# EAGLE schematic Smart_IOT_v1 (EAGLE 6.6.0)
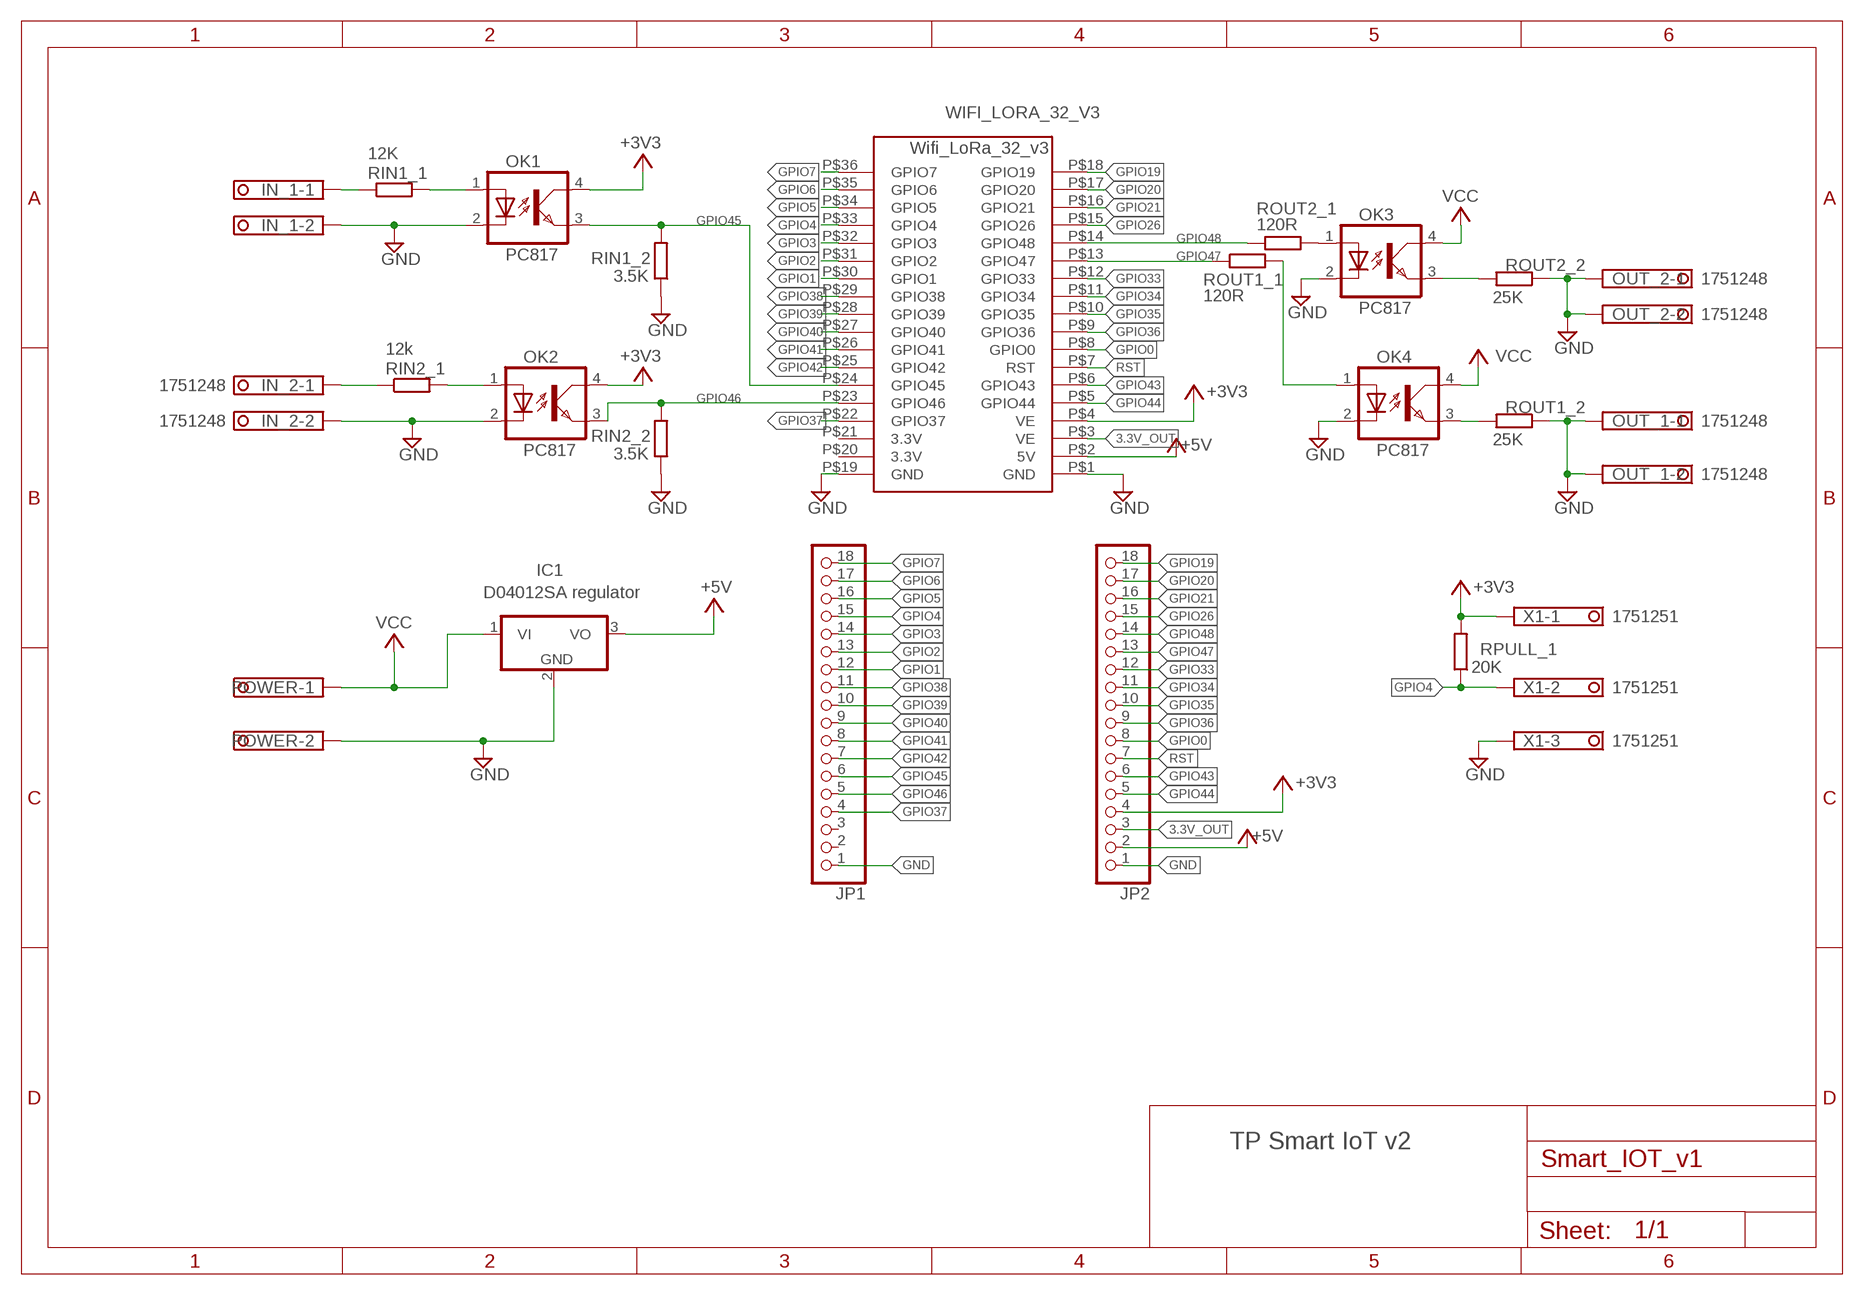
[diagram p0: schematic, sheet 1]

## Parts
IC1  7805TV  [TO220V]
IN_1  1751248  [1751248]
IN_2  1751248  [1751248]
JP1  PINHD-1X18  [1X18]
JP2  PINHD-1X18  [1X18]
OK1  PC817  [DIL04]
OK2  PC817  [DIL04]
OK3  PC817  [DIL04]
OK4  PC817  [DIL04]
OUT_1  1751248  [1751248]
OUT_2  1751248  [1751248]
POWER  1751248  [1751248]
RIN1_1  12K  R-EU_M1206  [M1206]
RIN1_2  3.5K  R-EU_M1206  [M1206]
RIN2_1  12k  R-EU_M1206  [M1206]
RIN2_2  3.5K  R-EU_M1206  [M1206]
ROUT1_1  120R  R-EU_M1206  [M1206]
ROUT1_2  25K  R-EU_M1206  [M1206]
ROUT2_1  120R  R-EU_M1206  [M1206]
ROUT2_2  25K  R-EU_M1206  [M1206]
RPULL_1  20K  R-EU_M1206  [M1206]
WIFI_LORA_32_V3  WIFI_LORA_32_V3  [WIFI_LORA_32_V3]
X1  1751251  [1751251]

## Nets
3.3V_OUT: JP2.3 WIFI_LORA_32_V3.P$3(VE)
+3V3: JP2.4 OK1.4(COL) OK2.4(COL) RPULL_1.2 WIFI_LORA_32_V3.P$4(VE) X1.1
+5V: IC1.3(VO) JP2.2 WIFI_LORA_32_V3.P$2(5V)
GND: IC1.2(GND) IN_1.2 IN_2.2 JP1.1 JP2.1 OK1.2(C) OK2.2(C) OK3.2(C) OK4.2(C) OUT_1.1 OUT_1.2 OUT_2.1 OUT_2.2 POWER.2 RIN1_2.1 RIN2_2.1 ROUT1_2.1 ROUT2_2.1 WIFI_LORA_32_V3.P$1(GND) WIFI_LORA_32_V3.P$19(GND) X1.3
GPIO0: JP2.8 WIFI_LORA_32_V3.P$8(GPIO0)
GPIO1: JP1.12 WIFI_LORA_32_V3.P$30(GPIO1)
GPIO2: JP1.13 WIFI_LORA_32_V3.P$31(GPIO2)
GPIO3: JP1.14 WIFI_LORA_32_V3.P$32(GPIO3)
GPIO4: JP1.15 RPULL_1.1 WIFI_LORA_32_V3.P$33(GPIO4) X1.2
GPIO5: JP1.16 WIFI_LORA_32_V3.P$34(GPIO5)
GPIO6: JP1.17 WIFI_LORA_32_V3.P$35(GPIO6)
GPIO7: JP1.18 WIFI_LORA_32_V3.P$36(GPIO7)
GPIO19: JP2.18 WIFI_LORA_32_V3.P$18(GPIO19)
GPIO20: JP2.17 WIFI_LORA_32_V3.P$17(GPIO20)
GPIO21: JP2.16 WIFI_LORA_32_V3.P$16(GPIO21)
GPIO26: JP2.15 WIFI_LORA_32_V3.P$15(GPIO26)
GPIO33: JP2.12 WIFI_LORA_32_V3.P$12(GPIO33)
GPIO34: JP2.11 WIFI_LORA_32_V3.P$11(GPIO34)
GPIO35: JP2.10 WIFI_LORA_32_V3.P$10(GPIO35)
GPIO36: JP2.9 WIFI_LORA_32_V3.P$9(GPIO36)
GPIO37: JP1.4 WIFI_LORA_32_V3.P$22(GPIO37)
GPIO38: JP1.11 WIFI_LORA_32_V3.P$29(GPIO38)
GPIO39: JP1.10 WIFI_LORA_32_V3.P$28(GPIO39)
GPIO40: JP1.9 WIFI_LORA_32_V3.P$27(GPIO40)
GPIO41: JP1.8 WIFI_LORA_32_V3.P$26(GPIO41)
GPIO42: JP1.7 WIFI_LORA_32_V3.P$25(GPIO42)
GPIO43: JP2.6 WIFI_LORA_32_V3.P$6(GPIO43)
GPIO44: JP2.5 WIFI_LORA_32_V3.P$5(GPIO44)
GPIO45: JP1.6 OK1.3(EMIT) RIN1_2.2 WIFI_LORA_32_V3.P$24(GPIO45)
GPIO46: JP1.5 OK2.3(EMIT) RIN2_2.2 WIFI_LORA_32_V3.P$23(GPIO46)
GPIO47: JP2.13 ROUT1_1.1 WIFI_LORA_32_V3.P$13(GPIO47)
GPIO48: JP2.14 ROUT2_1.1 WIFI_LORA_32_V3.P$14(GPIO48)
N$2: IN_1.1 RIN1_1.1
N$3: OK1.1(A) RIN1_1.2
N$5: IN_2.1 RIN2_1.1
N$6: OK2.1(A) RIN2_1.2
N$7: OK3.1(A) ROUT2_1.2
N$8: OK3.3(EMIT) ROUT2_2.2
N$10: OK4.1(A) ROUT1_1.2
N$15: OK4.3(EMIT) ROUT1_2.2
RST: JP2.7 WIFI_LORA_32_V3.P$7(RST)
VCC: IC1.1(VI) OK3.4(COL) OK4.4(COL) POWER.1
Unconnected: JP1.2 JP1.3 WIFI_LORA_32_V3.P$20(3.3V) WIFI_LORA_32_V3.P$21(3.3V)

## Notes on the sheet
- D04012SA regulator
- TP Smart IoT v2

## Library data of the parts
IC1 = linear:78*: Positive VOLTAGE REGULATOR Source: http://cache.national.com/ds/LM/LM78L05.pdf http://www.fairchildsemi.com/ds/LM/LM7805.pdf
IN_1 IN_2 OUT_1 OUT_2 POWER = con-phoenix-350:1751248: MKDS 1/ 2-3,5 Printklemme Nennstrom: 10 A Bemessungsspannung: 160 V Raster: 3,5 mm Polzahl: 2 Montageart: Löten Anschlussart: Schraubanschluss Anschlussrichtung vom Leiter zur Platine: 0° Source: http://eshop.phoenixcontact.com .. 1751248.pdf; OC_FARNELL: unknown; OC_NEWARK: unknown
JP1 JP2 = pinhead:PINHD-1X18: PIN HEADER
OK1-OK4 = optocoupler:PC817: SHARP OPTO COUPLER; MPN: PC817X4J000F; OC_FARNELL: 9707727; OC_NEWARK: 97K7059
RIN1_1 RIN1_2 RIN2_1 RIN2_2 ROUT1_1 ROUT1_2 ROUT2_1 ROUT2_2 RPULL_1 = rcl:R-EU_: RESISTOR, European symbol
WIFI_LORA_32_V3 = simon:WIFI_LORA_32_V3: Wifi LoRA ESP32 version 3 by HELTEC
X1 = con-phoenix-350:1751251: MKDS 1/ 3-3,5 Printklemme Nennstrom: 10 A Bemessungsspannung: 160 V Raster: 3,5 mm Polzahl: 3 Montageart: Löten Anschlussart: Schraubanschluss Anschlussrichtung vom Leiter zur Platine: 0° Source: http://eshop.phoenixcontact.com .. 1751251.pdf; OC_FARNELL: unknown; OC_NEWARK: unknown